# EasyEDA schematic SCH_RelayModule.json
TITLE: CLCRM; REV: 1.2; Date: 2022-08-15; Sheet: 1/1; Drawn By: Cyrus Brunner; Company: CyrusBuilt
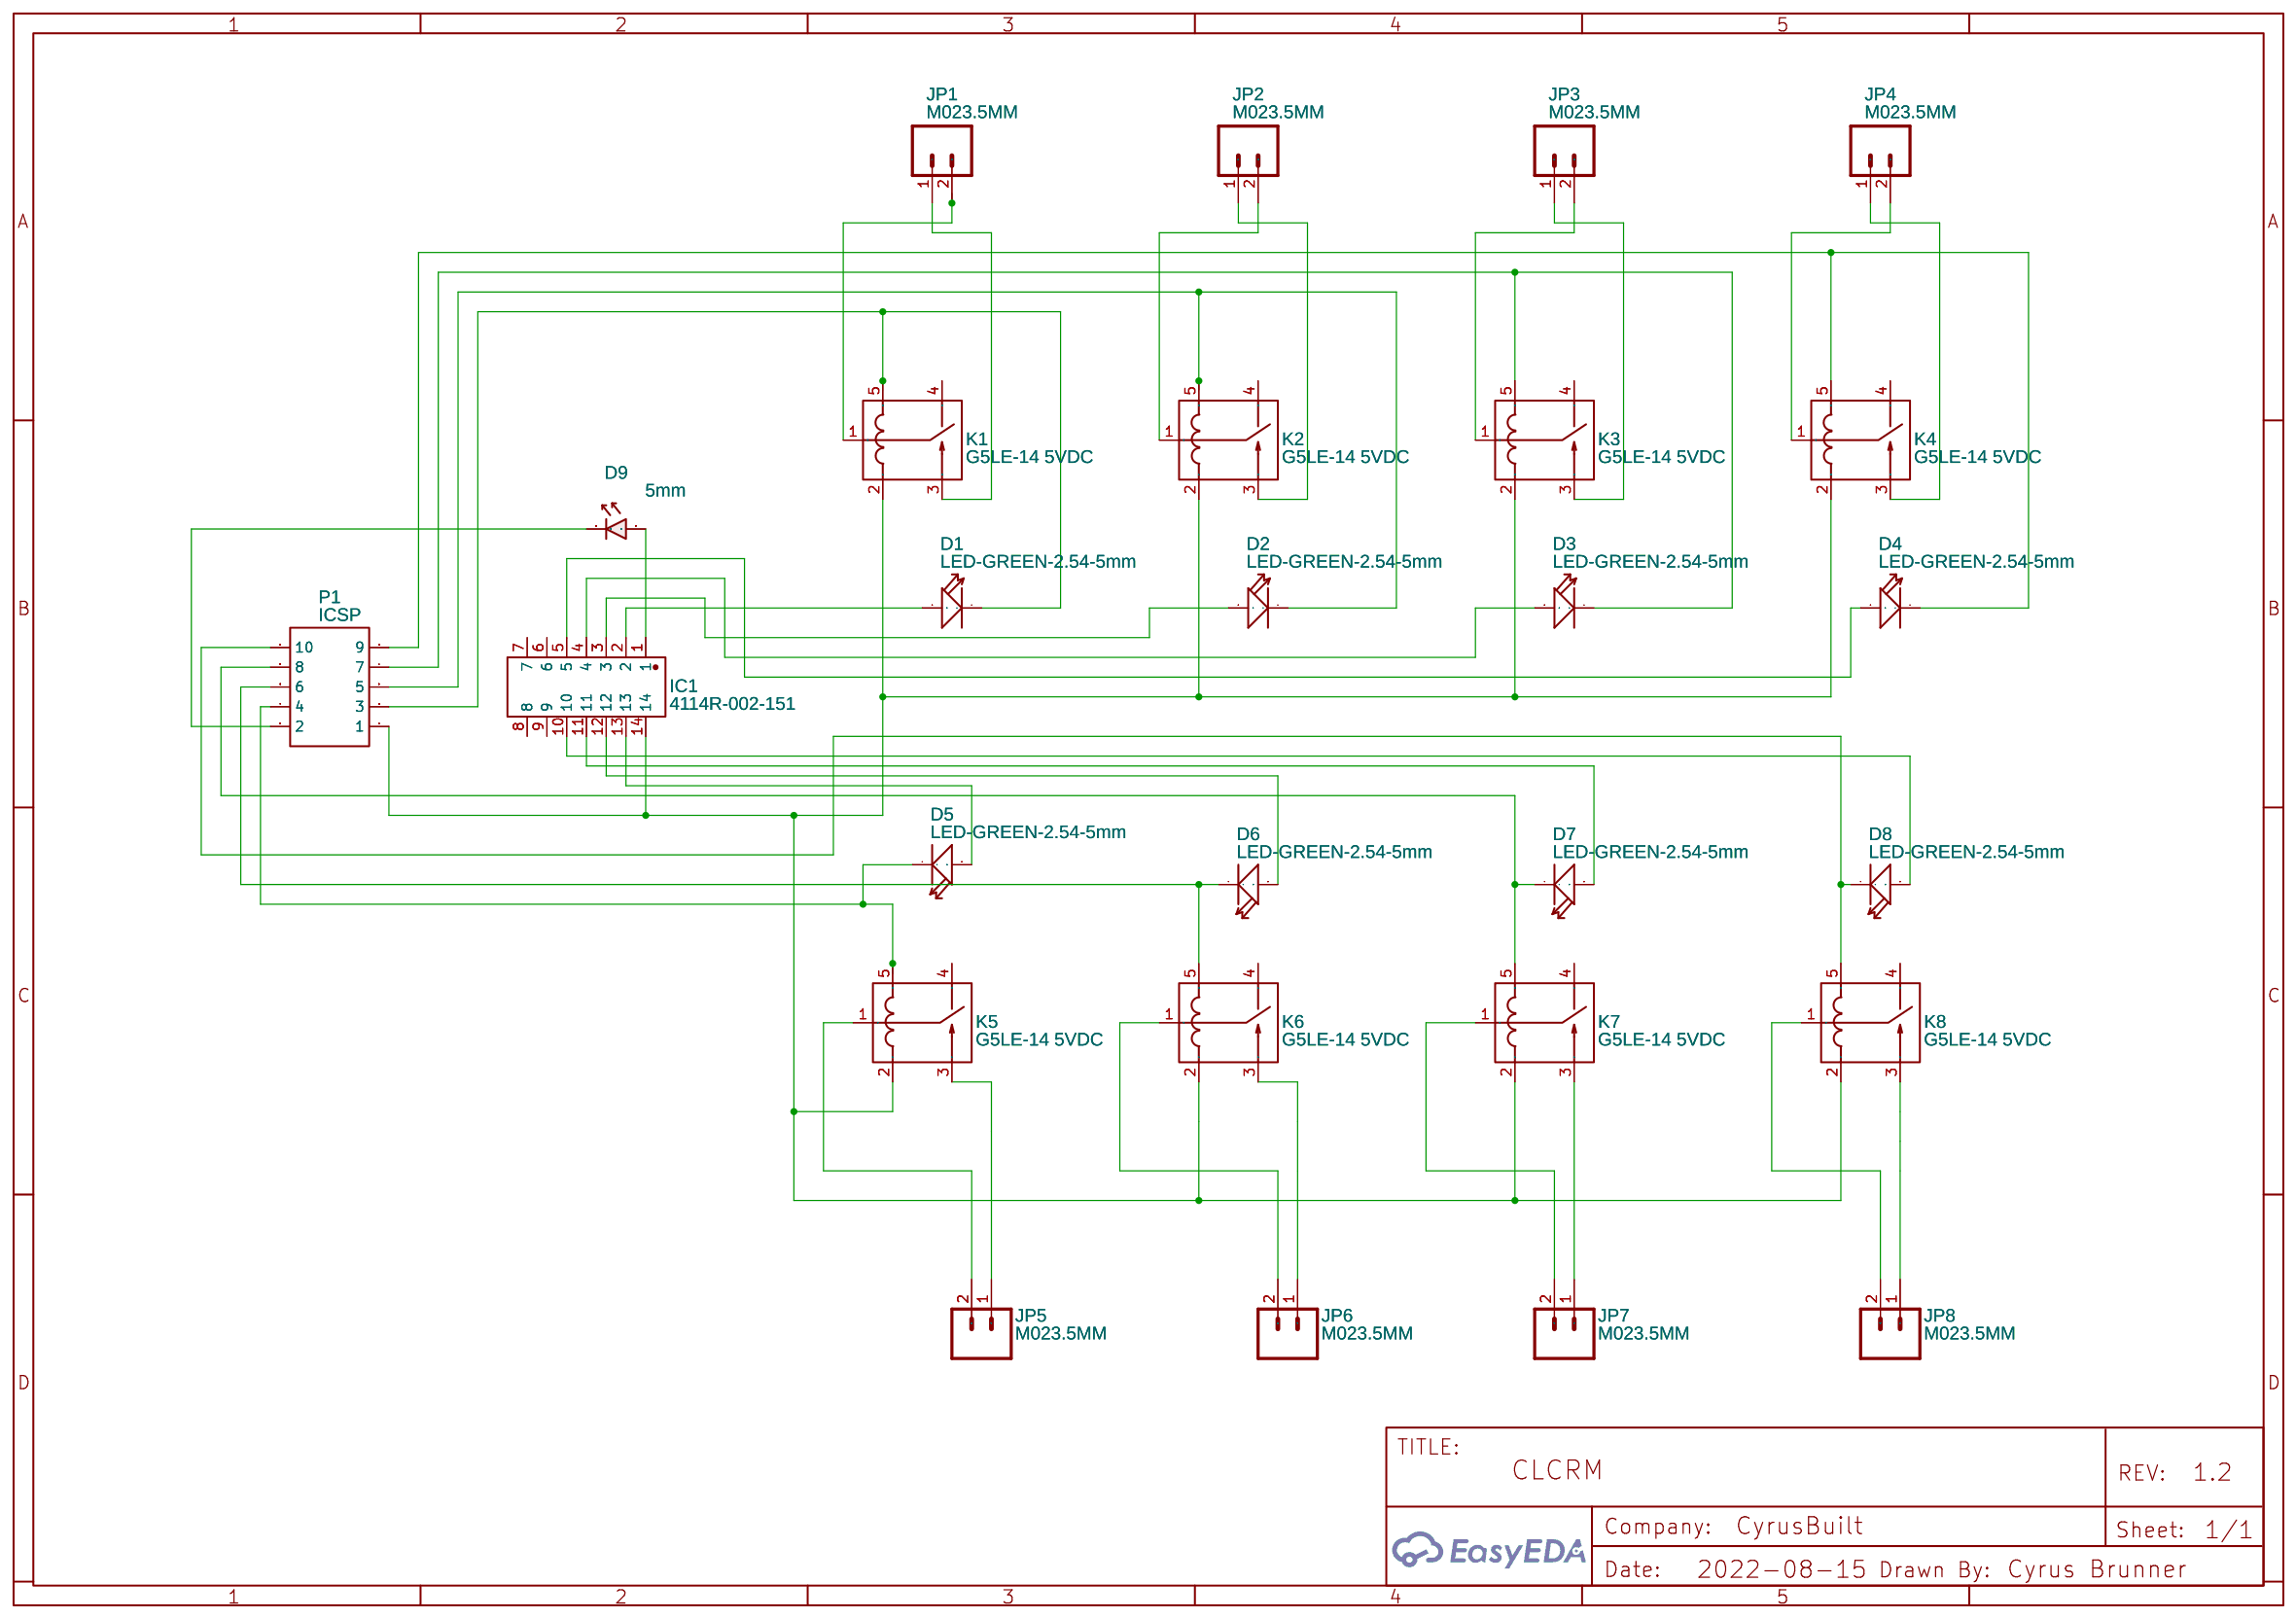
[diagram p0: schematic sheet]

## Parts
D1  LED-GREEN-2.54-5mm  [LED-GREEN-2.54-5MM-YUN]
D2  LED-GREEN-2.54-5mm  [LED-GREEN-2.54-5MM-YUN]
D3  LED-GREEN-2.54-5mm  [LED-GREEN-2.54-5MM-YUN]
D4  LED-GREEN-2.54-5mm  [LED-GREEN-2.54-5MM-YUN]
D5  LED-GREEN-2.54-5mm  [LED-GREEN-2.54-5MM-YUN]
D6  LED-GREEN-2.54-5mm  [LED-GREEN-2.54-5MM-YUN]
D7  LED-GREEN-2.54-5mm  [LED-GREEN-2.54-5MM-YUN]
D8  LED-GREEN-2.54-5mm  [LED-GREEN-2.54-5MM-YUN]
D9  5mm  [PKG-LED-5MM-RED]
IC1  4114R-002-151  [DIP-14_L17.8-W10.2-P2.54-BL]
JP1  M023.5MM  [SCREWTERMINAL-3.5MM-2]
JP2  M023.5MM  [SCREWTERMINAL-3.5MM-2]
JP3  M023.5MM  [SCREWTERMINAL-3.5MM-2]
JP4  M023.5MM  [SCREWTERMINAL-3.5MM-2]
JP5  M023.5MM  [SCREWTERMINAL-3.5MM-2]
JP6  M023.5MM  [SCREWTERMINAL-3.5MM-2]
JP7  M023.5MM  [SCREWTERMINAL-3.5MM-2]
JP8  M023.5MM  [SCREWTERMINAL-3.5MM-2]
K1  G5LE-14 5VDC  [RELAY-TH_G5LE-14-XX]
K2  G5LE-14 5VDC  [RELAY-TH_G5LE-14-XX]
K3  G5LE-14 5VDC  [RELAY-TH_G5LE-14-XX]
K4  G5LE-14 5VDC  [RELAY-TH_G5LE-14-XX]
K5  G5LE-14 5VDC  [RELAY-TH_G5LE-14-XX]
K6  G5LE-14 5VDC  [RELAY-TH_G5LE-14-XX]
K7  G5LE-14 5VDC  [RELAY-TH_G5LE-14-XX]
K8  G5LE-14 5VDC  [RELAY-TH_G5LE-14-XX]
P1  ICSP  [HDR-IDC-2.54-2X5P]

## Library data of the parts
D1-D8 = LED-GREEN-2.54-5mm: DIP LED Transparent-Orange;; Manufacturer Part: 503UOC; Contributor: koreawide
D9 = RED LED: Color: Red; WaveLength: 617nm; Forward Voltage: 2.0V; Manufacturer: KINGBRIGHT; Manufacturer Part: L-1503EC; Supplier Part: 1003201; Supplier: Element14; link: http://www.farnell.com/datasheets/2046493.pdf?_ga=2.91228057.244688081.1505921947-238689616.1505921947&_gac=1.213042848.1505921947.EAIaIQobChMIsdP1s4y01gIVhxwbCh2_CAopEAAYASAAEgKnhPD_BwE; Contributor: Prof. Ing. F. Scordino
IC1 = 100-143-200-1001-00: Supplier: LCSC; Supplier Part: C2846065; Manufacturer: Nextron(台湾正凌); Contributor: LCSC; JLCPCB Part Class: Extended Part
JP1-JP8 = M023.5MM: Contributor: CNC Projects by Marcus Volk
K1-K8 = G5LE-14 5VDC: Supplier: LCSC; Supplier Part: C116963; Manufacturer: Omron Electronics; Contributor: LCSC; JLCPCB Part Class: Extended Part
P1 = ICSP: Supplier: LCSC; Manufacturer: BOOMELE; Manufacturer Part: IDC Box 2.54mm 2X5P; image: //image.lceda.cn/szlcsc/C5665.jpg; Supplier Part: C5665; Contributor: NewburyPi

## Nets
Net-(D1-+): D1.+ IC1.2
Net-(D1--): D1.- K1.5 P1.3
Net-(D2-+): D2.+ IC1.3
Net-(D2--): D2.- K2.5 P1.5
Net-(D3-+): D3.+ IC1.4
Net-(D3--): D3.- K3.5 P1.7
Net-(D4-+): D4.+ IC1.5
Net-(D4--): D4.- K4.5 P1.9
Net-(D5-+): D5.+ IC1.13
Net-(D5--): D5.- K5.5 P1.4
Net-(D6-+): D6.+ IC1.12
Net-(D6--): D6.- K6.5 P1.6
Net-(D7-+): D7.+ IC1.11
Net-(D7--): D7.- K7.5 P1.8
Net-(D8-+): D8.+ IC1.10
Net-(D8--): D8.- K8.5 P1.10
Net-(D9-1): D9.1 IC1.1
Net-(D9-2): D9.2 P1.2
Net-(IC1-14): IC1.14 K1.2 K2.2 K3.2 K4.2 K5.2 K6.2 K7.2 K8.2 P1.1
Net-(JP1-1): JP1.1 K1.3
Net-(JP1-2): JP1.2 K1.1
Net-(JP2-1): JP2.1 K2.3
Net-(JP2-2): JP2.2 K2.1
Net-(JP3-1): JP3.1 K3.3
Net-(JP3-2): JP3.2 K3.1
Net-(JP4-1): JP4.1 K4.3
Net-(JP4-2): JP4.2 K4.1
Net-(JP5-1): JP5.1 K5.3
Net-(JP5-2): JP5.2 K5.1
Net-(JP6-1): JP6.1 K6.3
Net-(JP6-2): JP6.2 K6.1
Net-(JP7-1): JP7.1 K7.3
Net-(JP7-2): JP7.2 K7.1
Net-(JP8-1): JP8.1 K8.3
Net-(JP8-2): JP8.2 K8.1

Not connected (* = marked no-connect by the designer): IC1 6 7 8 9; K1 4; K2 4; K3 4; K4 4; K5 4; K6 4; K7 4; K8 4
